# EAGLE design I2C motor controller (EAGLE 9.5.1)
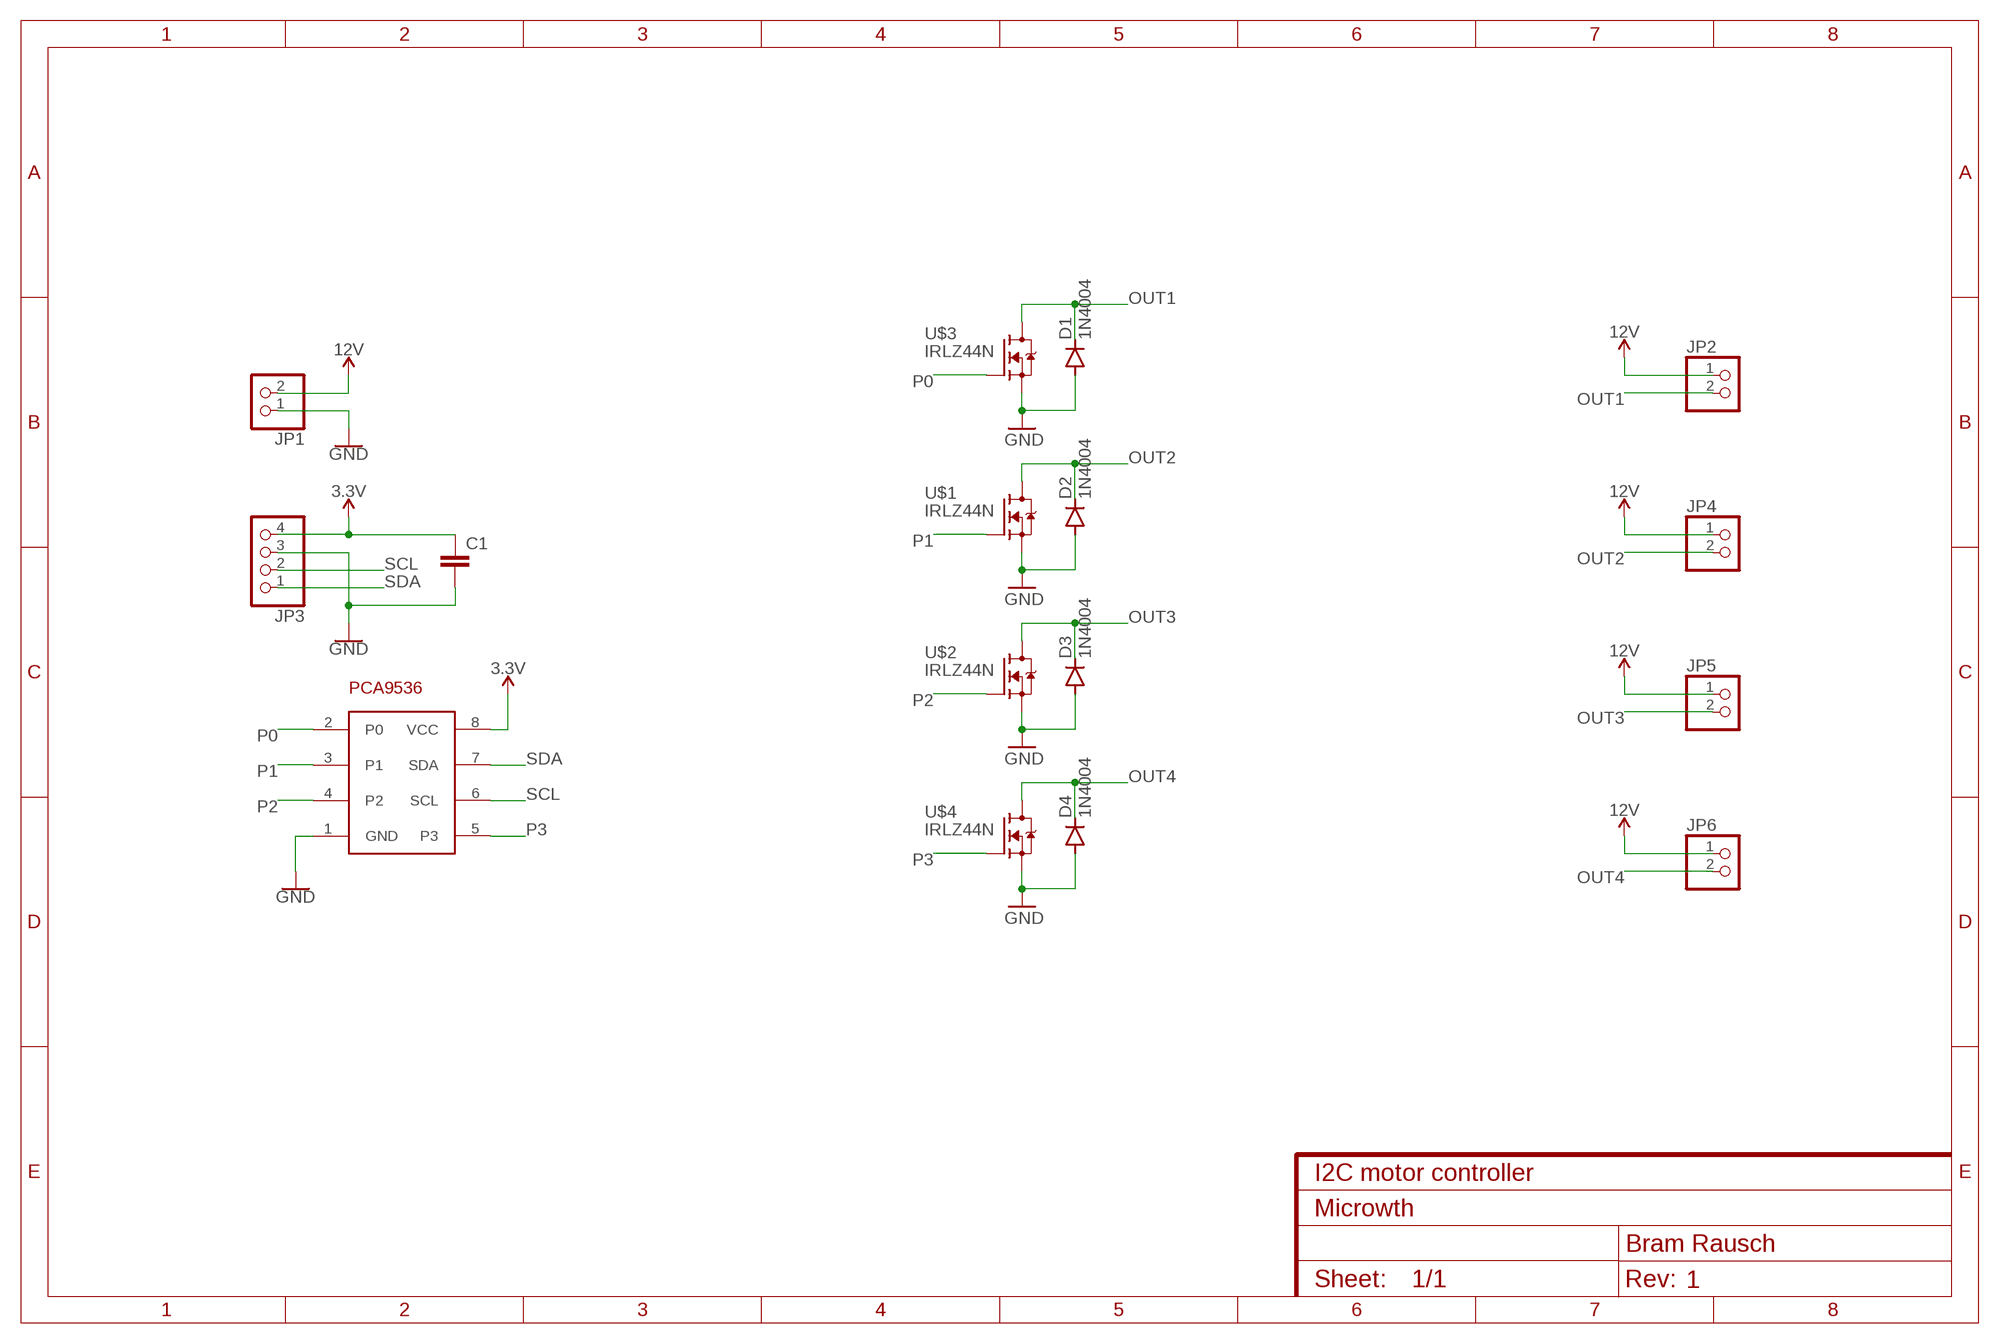
[diagram p0: schematic, sheet 1]
FRAME1 (FRAME-A4L): PROJECT: Microwth; TITLE: I2C motor controller

## Parts
C1  C-EUC0805  [C0805]
D1  1N4004  [DO41-10]
D2  1N4004  [DO41-10]
D3  1N4004  [DO41-10]
D4  1N4004  [DO41-10]
JP1  PINHD-1X2  [1X02]
JP2  PINHD-1X2  [1X02]
JP3  PINHD-1X4  [1X04]
JP4  PINHD-1X2  [1X02]
JP5  PINHD-1X2  [1X02]
JP6  PINHD-1X2  [1X02]
PCA9536  PCA9536DGK  [SOP65P490X110-8N]
U$1  IRLZ44N  [TO220]
U$2  IRLZ44N  [TO220]
U$3  IRLZ44N  [TO220]
U$4  IRLZ44N  [TO220]

## Nets
3.3V: C1.1 JP3.4 PCA9536.8(VCC)
12V: JP1.2 JP2.1 JP4.1 JP5.1 JP6.1
GND: C1.2 D1.A D2.A D3.A D4.A JP1.1 JP3.3 PCA9536.1(GND) U$1.3(S) U$2.3(S) U$3.3(S) U$4.3(S)
OUT1: D1.C JP2.2 U$3.2(D)
OUT2: D2.C JP4.2 U$1.2(D)
OUT3: D3.C JP5.2 U$2.2(D)
OUT4: D4.C JP6.2 U$4.2(D)
P0: PCA9536.2(P0) U$3.1(G)
P1: PCA9536.3(P1) U$1.1(G)
P2: PCA9536.4(P2) U$2.1(G)
P3: PCA9536.5(P3) U$4.1(G)
SCL: JP3.2 PCA9536.6(SCL)
SDA: JP3.1 PCA9536.7(SDA)

## Library data of the parts
C1 = rcl:C-EU: CAPACITOR, European symbol; SPICEPREFIX: C
D1-D4 = diode:1N4004: DIODE general purpose rectifier, 1 A
JP1 JP2 JP4-JP6 = pinhead:PINHD-1X2: PIN HEADER
JP3 = pinhead:PINHD-1X4: PIN HEADER
PCA9536 = Microwth:PCA9536
U$1-U$4 = transistor-fet:IRLZ44N

## Board
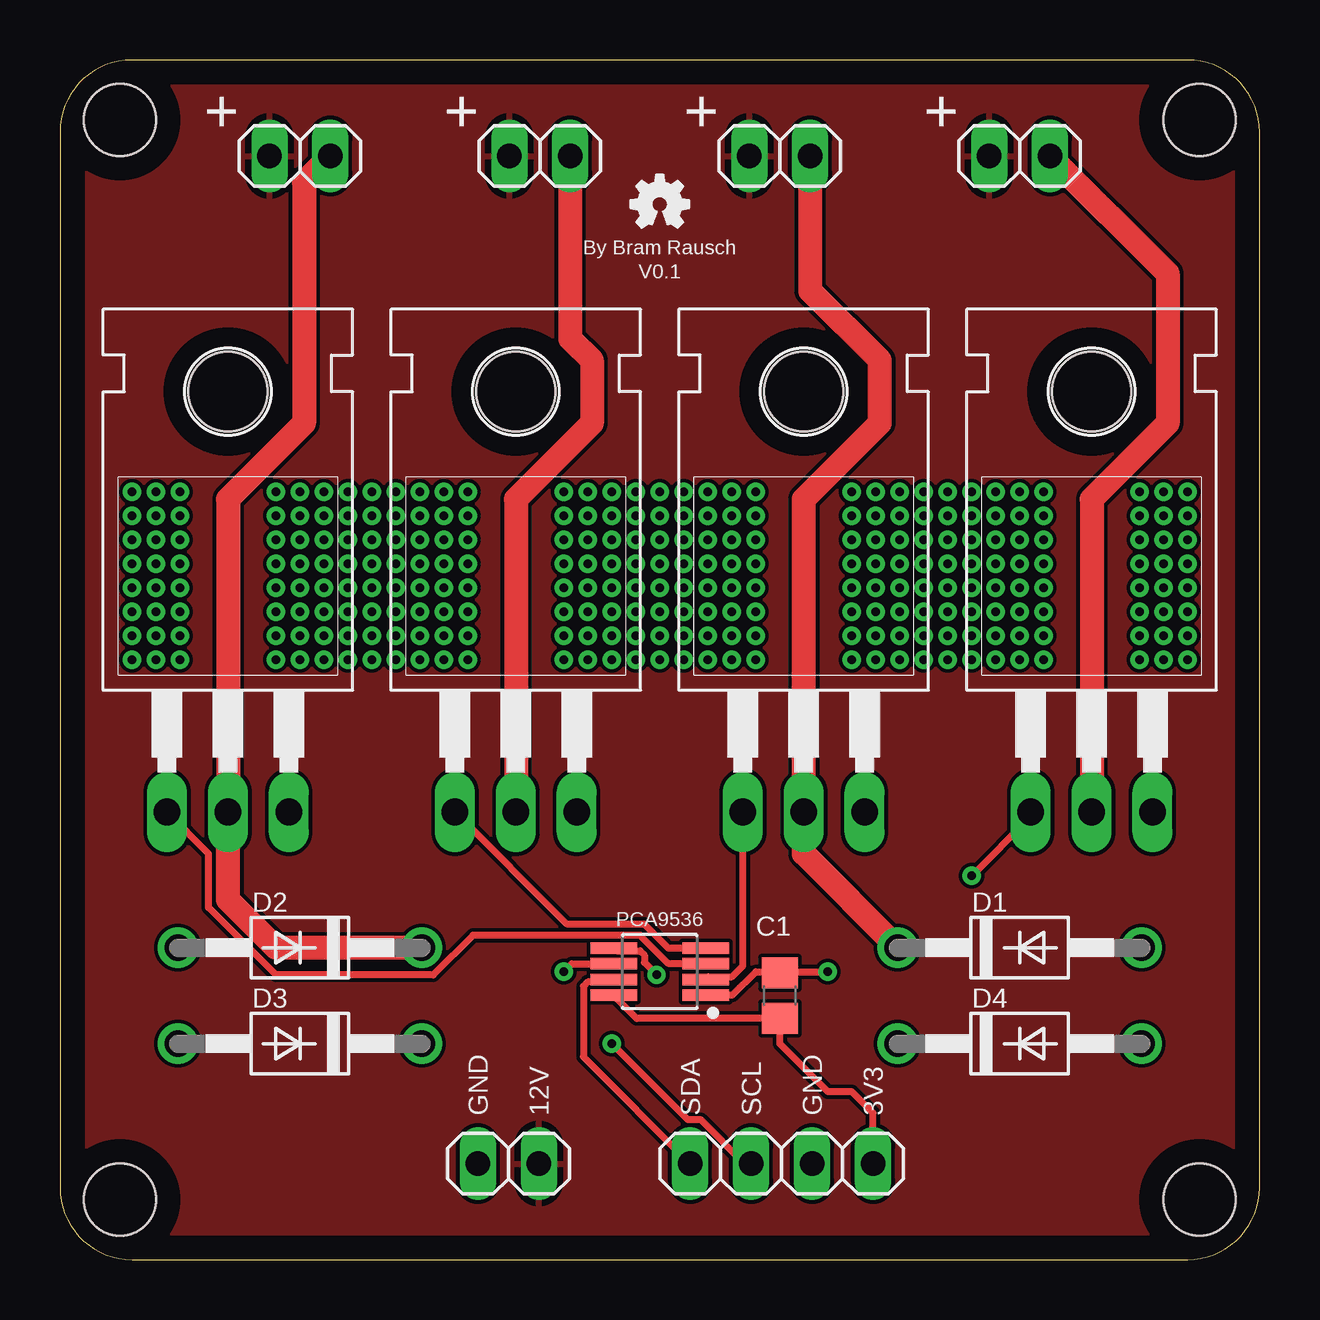
[diagram p1: board, top side]
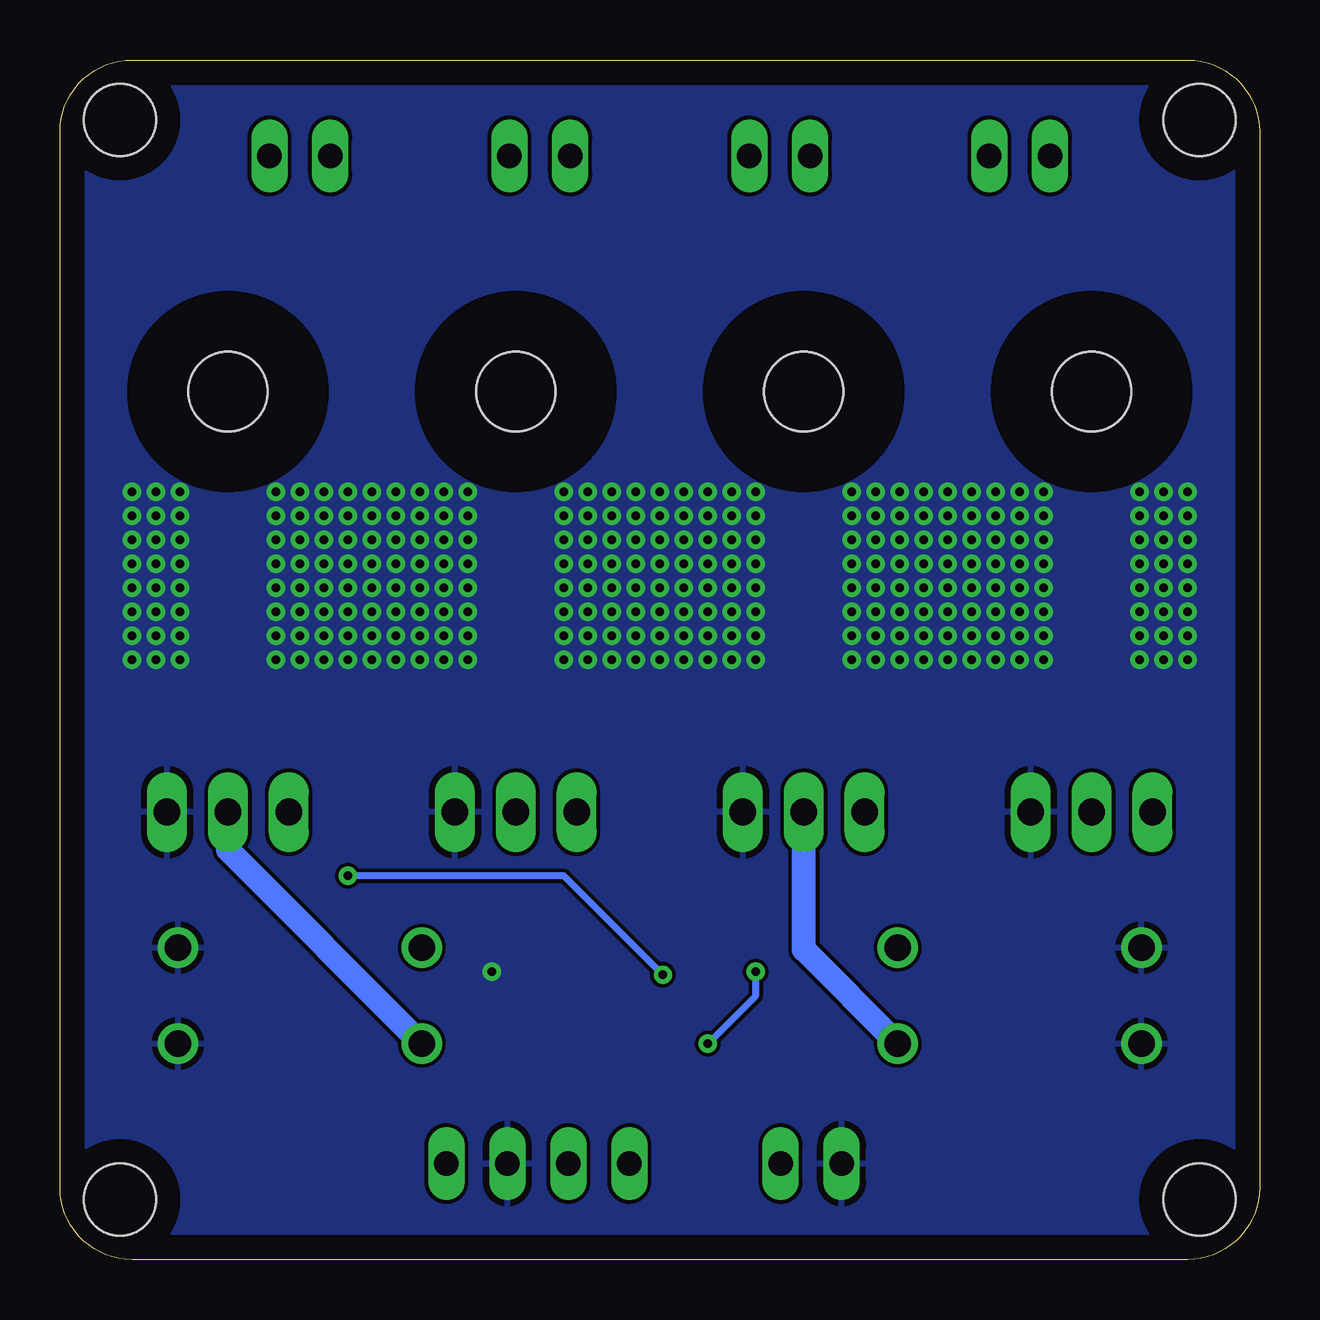
[diagram p2: board, bottom side, seen from below]

Size 50 x 50 mm. Coordinates in mm from the lower left corner, seen from the top.
Outline: 3,0 47,0 arc90 50,3 50,47 arc90 47,50 3,50 arc90 0,47 0,3 arc90 3,0
Copper layers (1*16): Top 0.035mm / dielectric 1.5mm / Bottom 0.035mm
Design rules "default": minimum track width 6mil, minimum drill 0.35mm, track to track 6mil, track to pad 6mil, pad to pad 6mil, via to via 6mil, smd to smd 6mil, copper to edge 40mil, drill to drill 6mil, minimum pad ring 10mil, minimum via ring 8mil, stop-mask expansion 4mil, vias tented up to drill 0mil, thermal gap 10mil
Holes 3 mm at 2.5,2.5 2.5,47.5 47.5,47.5 47.5,2.5

### Footprints (pad centres in the part's own frame; a part is rotated, then mirrored left to right if it is on the bottom)
C0805 = smd 1.3 x 1.5: 1 -0.95,0; 2 0.95,0
DO41-10 = drill 1.118: A 5.08,0; C -5.08,0
1X02 = drill 1.016 long: 1 -1.27,0; 2 1.27,0
1X04 = drill 1.016 long: 1 -3.81,0; 2 -1.27,0; 3 1.27,0; 4 3.81,0
SOP65P490X110-8N = smd 1.939 x 0.481: 1 -1.915,0.975; 2 -1.915,0.325; 3 -1.915,-0.325; 4 -1.915,-0.975; 5 1.915,-0.975; 6 1.915,-0.325; 7 1.915,0.325; 8 1.915,0.975
TO220 = drill 1.118 long: 1 -2.54,-6.35; 2 0,-6.35; 3 2.54,-6.35 | hole 3.302: 0,11.176

### Placement (x,y rotation side)
C1  30,11 90 top
D1  40,13 0 top
D2  10,13 180 top
D3  10,9 180 top
D4  40,9 0 top
JP1  18.69,4 0 top
JP2  30,46 0 top
JP3  30.08,4 0 top
JP4  10,46 0 top
JP5  20,46 0 top
JP6  40,46 0 top
PCA9536  25,12 180 top
U$1  7,25 0 top
U$2  19,25 0 top
U$3  31,25 0 top
U$4  43,25 0 top
U$5  [OSHW-LOGO-MINI]  25,44 0 top

### Tracks (layer width: path | path; a pad name or v marks a point on that pad's centre or on a via)
3.3V
  Top 0.3: PCA9536.8 23.08,11 24.04,10.05 C1.1 30,9 32,7 33,7 33.89,6.11 JP3.4 33.89,4.11
12V
  pour Top: 22,0 0,0 0,50 50,50 50,0
GND  (via drill 0.35)
  Top 0.3: PCA9536.1 28.02,11.03 29,12 29.95,12 C1.2 30.05,12 v32,12
  other vias: 3,32 3,31 3,30 3,29 3,28 3,27 3,26 3,25 4,25 4,26 4,27 4,28 4,29 4,30 4,31 4,32 5,32 5,31 5,30 5,29 5,28 5,27 5,26 5,25 9,25 9,26 9,27 9,28 9,29 9,30 9,31 9,32 10,32 11,32 11,31 10,31 10,30 11,30 11,29 10,29 10,28 11,28 11,27 10,27 10,26 11,26 11,25 10,25 12,32 13,32 14,32 15,32 16,32 17,32 17,31 17,30 17,29 17,28 17,27 17,26 17,25 16,25 15,25 14,25 13,25 12,25 12,26 12,27 12,28 12,29 12,30 12,31 13,31 13,30 13,29 13,28 13,27 13,26 14,26 14,27 14,28 14,29 14,30 14,31 15,31 16,31 16,30 15,30 15,29 16,29 16,28 15,28 15,27 16,27 16,26 15,26 21,32 22,32 23,32 23,31 22,31 21,31 21,30 22,30 23,30 24,30 25,30 26,30 27,30 28,30 29,30 29,31 29,32 28,32 28,31 27,32 27,31 26,31 26,32 25,32 25,31 24,31 24,32 21,29 21,28 21,27 21,26 21,25 22,25 22,26 22,27 22,28 22,29 23,29 23,28 23,27 23,26 23,25 24,25 24,26 24,27 24,28 24,29 25,29 25,28 25,27 25,26 25,25 26,25 26,26 26,27 26,28 26,29 27,29 27,28 27,27 27,26 27,25 28,25 28,26 28,27 28,28 28,29 29,29 29,28 29,27 29,26 29,25 33,25 35,25 35,26 34,26 33,26 33,27 34,27 35,27 35,28 34,28 33,28 33,29 34,29 35,29 35,30 34,30 33,30 33,31 33,32 34,32 34,31 35,31 35,32 36,32 37,32 38,32 39,32 40,32 41,32 41,31 40,31 39,31 38,31 37,31 36,31 36,30 37,30 38,30 39,30 40,30 41,30 41,29 40,29 39,29 38,29 37,29 36,29 36,28 37,28 38,28 39,28 40,28 41,28 41,27 40,27 39,27 38,27 37,27 36,27 36,26 37,26 38,26 39,26 40,26 41,26 41,25 40,25 39,25 38,25 37,25 36,25 45,32 45,31 45,30 45,29 45,28 45,27 45,26 45,25 46,25 47,25 47,26 46,26 46,27 47,27 47,28 46,28 46,29 47,29 47,30 46,30 46,31 47,31 47,32 46,32 34,25
  pour Bottom: -1,51 -1,-4 51,-4 53,-2 53,51 51,53 1,53
OUT1
  Top 1: JP2.2 31.27,40.38 34.17,37.49 34.17,34.86 31,31.7 U$3.2 31,16.92 D1.C
OUT2
  Top 1: JP4.2 10.17,44.9 10.17,34.86 7,31.7 U$1.2 7,15 9,13 D2.C
OUT3
  Top 1: U$2.2 19,31.7 22.17,34.86 22.17,37.49 21.27,38.38 JP5.2
  Bottom 1: D3.C 19,12.92 U$2.2
OUT4
  Top 1: U$4.2 43,31.7 46.17,34.86 46.17,41.1 JP6.2
  Bottom 1: D4.C 43,17.08 U$4.2
P0
  Top 0.3: PCA9536.2 27.02,11.78 28.01,11.78 28.46,12.23 U$3.1
P1
  Top 0.3: PCA9536.3 25.37,12.32 24.18,13.52 17.21,13.52 15.55,11.86 9.01,11.86 6.2,14.67 6.2,16.91 U$1.1
P2
  Top 0.3: PCA9536.4 25.36,12.97 24.37,13.97 21.14,13.97 U$2.1
P3  (via drill 0.35)
  Top 0.3: PCA9536.5 23.19,12.87 24.18,12.87 24.36,12.69 24.36,12.38 v24.87,11.87 | v38,16 40.46,18.46 U$4.1
  Bottom 0.3: v24.87,11.87 29,16 v38,16
SCL  (via drill 0.35)
  Top 0.3: v23,9 26.17,5.83 26.71,5.83 28.54,4 JP3.2 | v21,12 21.32,12.32 PCA9536.6
  Bottom 0.3: v23,9 21,11 v21,12
SDA
  Top 0.3: PCA9536.7 22.98,11.57 21.99,11.57 21.81,11.39 21.81,8.46 JP3.1

### Text on the board
tNames: + | + | + | + | By Bram Rausch | V0.1 | GND | 12V | SDA | SCL | GND | 3V3